# Altium project carte_action.PrjPcb
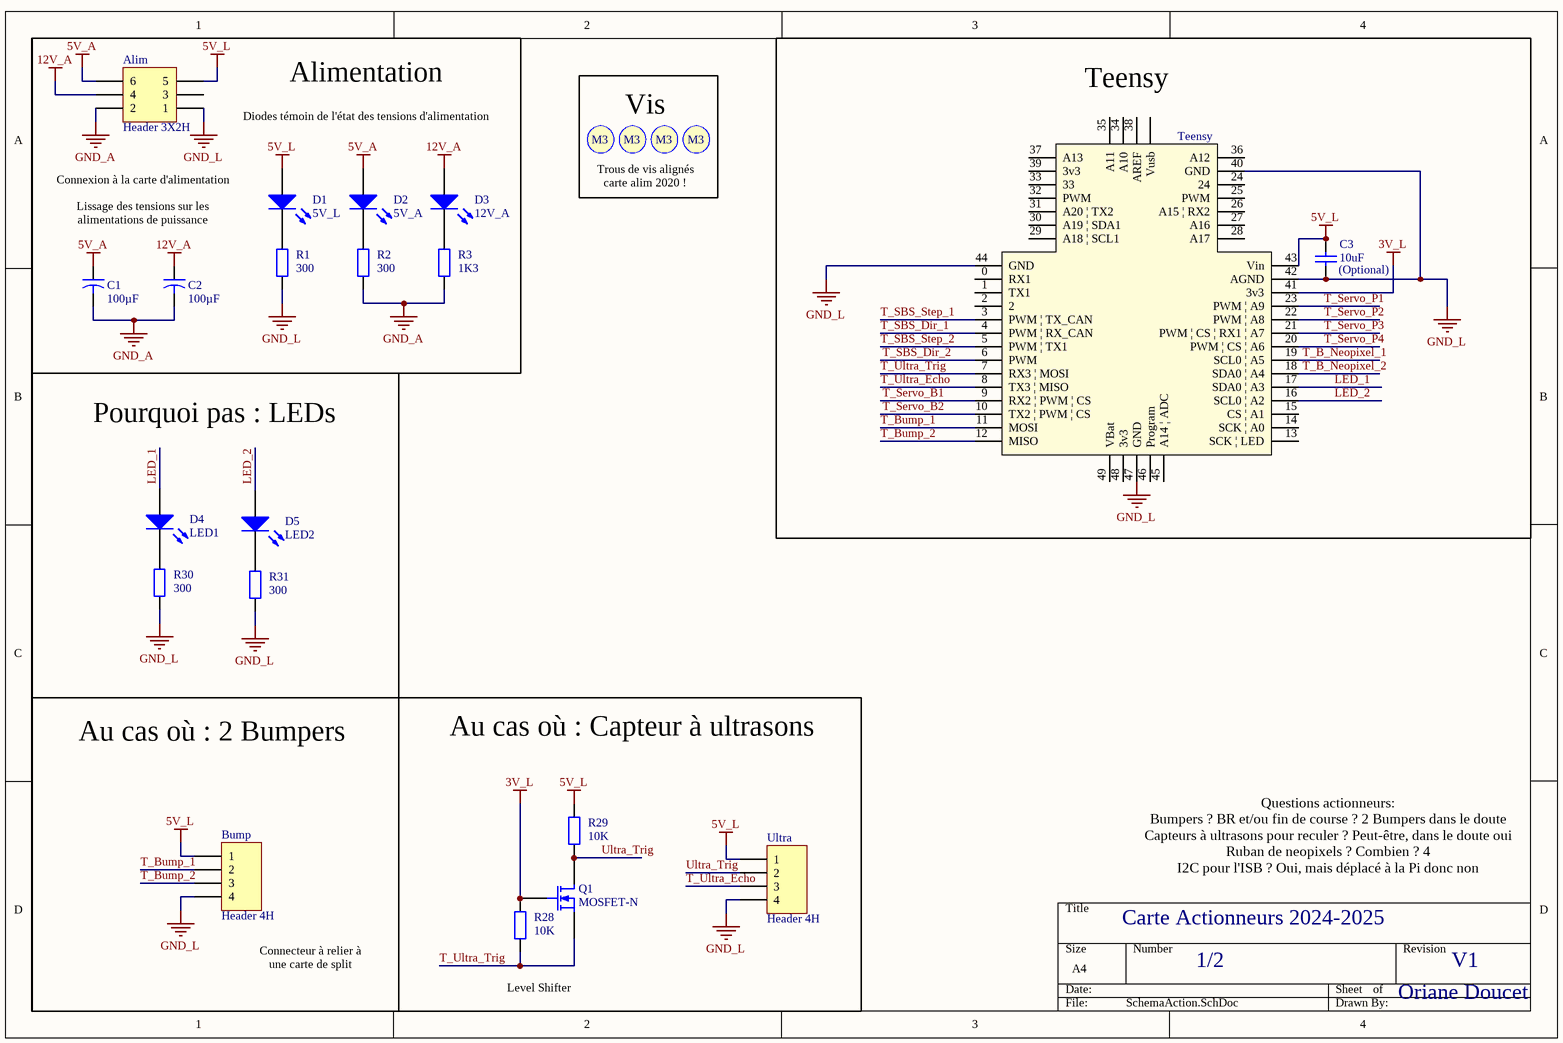
[diagram p0: SchemaAction.SchDoc]
2 sheets, 65 parts. Net scope: global (net labels, ports and power ports of the same name join across sheets).
Board file: PCBAction.PcbDoc
Sheets:
  SchemaAction.SchDoc
  SchemaAction_Actionneurs.SchDoc

## Sheet SchemaAction.SchDoc: Carte Actionneurs 2024-2025
size A4; DrawnBy: Oriane Doucet; DocumentNumber: 1/2; Revision: V1; SheetNumber: 1; SheetTotal: 2

### Parts
Alim  Header 3X2H  [MOLEX_MINIFITJR_3X2]
Bump  Header 4H  [S4B-XH-A]
C1  value 100µF  [Condensateur]  (hidden comment: Cap2)
C2  value 100µF  [Condensateur]  (hidden comment: Cap2)
C3  (Optional)  value 10uF  [Capacitor 1206]
D1  5V_L  [KP-3216SEC]
D2  5V_A  [KP-3216SEC]
D3  12V_A  [KP-3216SEC]
D4  LED1  [KP-3216SEC]
D5  LED2  [KP-3216SEC]
Q1  MOSFET-N  [SOT23_M]
R1  value 300  [Resistor 1206]  (hidden comment: Res2)
R2  value 300  [Resistor 1206]  (hidden comment: Res2)
R3  value 1K3  [Resistor 1206]  (hidden comment: Res2)
R28  value 10K  [Resistor 1206]  (hidden comment: Res2)
R29  value 10K  [Resistor 1206]  (hidden comment: Res2)
R30  value 300  [Resistor 1206]  (hidden comment: Res2)
R31  value 300  [Resistor 1206]  (hidden comment: Res2)
S1  Screw M3  [Screw M3]  (value not drawn)
S2  Screw M3  [Screw M3]  (value not drawn)
S3  Screw M3  [Screw M3]  (value not drawn)
S4  Screw M3  [Screw M3]  (value not drawn)
Teensy  Teensy 3.2  [teensy]  (value not drawn)
Ultra  Header 4H  [S4B-XH-A]

### Nets
3V_L: Q1.2(G) R28.1 Teensy.41(3v3)
5V_A: Alim.6 C1.1 D2.1(A)
5V_L: Alim.5 Bump.1 C3.2 D1.1(A) R29.1 Teensy.43(Vin) Ultra.1
12V_A: Alim.4 C2.1 D3.1(A)
GND_A: Alim.2 C1.2 C2.2 R2.2 R3.2
GND_L: Alim.1 Bump.4 C3.1 R1.1 R30.1 R31.1 Teensy.40(GND) Teensy.42(AGND) Teensy.44(GND) Teensy.47(GND) Ultra.4
LED_1: D4.1(A) Teensy.17(SDA0_|_A3)
LED_2: D5.1(A) Teensy.16(SCL0_|_A2)
T_B_Neopixel_1: Teensy.19(SCL0_|_A5)
T_B_Neopixel_2: Teensy.18(SDA0_|_A4)
T_Bump_1: Bump.2 Teensy.11(MOSI)
T_Bump_2: Bump.3 Teensy.12(MISO)
T_SBS_Dir_1: Teensy.4(PWM_|_RX_CAN)
T_SBS_Dir_2: Teensy.6(PWM)
T_SBS_Step_1: Teensy.3(PWM_|_TX_CAN)
T_SBS_Step_2: Teensy.5(PWM_|_TX1)
T_Servo_B1: Teensy.9(RX2_|_PWM_|_CS)
T_Servo_B2: Teensy.10(TX2_|_PWM_|_CS)
T_Servo_P1: Teensy.23(PWM_|_A9)
T_Servo_P2: Teensy.22(PWM_|_A8)
T_Servo_P3: Teensy.21(PWM_|_CS_|_RX1_|_A7)
T_Servo_P4: Teensy.20(PWM_|_CS_|_A6)
T_Ultra_Echo: Teensy.8(TX3_|_MISO) Ultra.3
T_Ultra_Trig: Q1.3(S) R28.2 Teensy.7(RX3_|_MOSI)
Ultra_Trig: Q1.1(D) R29.2 Ultra.2
NetD1_2: D1.2(K) R1.2
NetD2_2: D2.2(K) R2.1
NetD3_2: D3.2(K) R3.1
NetD4_2: D4.2(K) R30.2
NetD5_2: D5.2(K) R31.2

Not connected (* = marked no-connect by the designer): Alim 3; Teensy 0(RX1) 1(TX1) 2 13(SCK_|_LED) 14(SCK_|_A0) 15(CS_|_A1) 24 25(PWM) 26(A15_|_RX2) 27(A16) 28(A17) 29(A18_|_SCL1) 30(A19_|_SDA1) 31(A20_|_TX2) 32(PWM) 33 34(A10) 35(A11) 36(A12) 37(A13) 38(AREF) 39(3v3) 45(A14_|_ADC) 46(Program) 48(3v3) 49(VBat) 50(Vusb)

### Notes on the sheet
- Alimentation
- Vis
- (near Teensy) Teensy
- Connexion à la carte d'alimentation
- Diodes témoin de l'état des tensions d'alimentation
- Trous de vis alignés carte alim 2020 !
- Lissage des tensions sur les alimentations de puissance
- Pourquoi pas : LEDs
- Au cas où : 2 Bumpers
- Au cas où : Capteur à ultrasons
- Questions actionneurs:
  Bumpers ? BR et/ou fin de course ? 2 Bumpers dans le doute
  Capteurs à ultrasons pour reculer ? Peut-être, dans le doute oui
  Ruban de neopixels ? Combien ? 4
  I2C pour l'ISB ? Oui, mais déplacé à la Pi donc non
- Connecteur à relier à une carte de split
- (near R28) Level Shifter
- (in symbol Screw M3) M3

### Library data of the parts
Alim = Header 3X2H: Header, 3-Pin, Dual row, Right Angle; LatestRevisionDate: 17-Jul-2002; LatestRevisionNote: Re-released for DXP Platform.; Publisher: Altium Limited
Bump Ultra = Header 4H: Header, 4-Pin, Right Angle; LatestRevisionDate: 17-Jul-2002; LatestRevisionNote: Re-released for DXP Platform.; Publisher: Altium Limited
C1 C2 = Cap2: Capacitor; Published: 23-Sep-2002; PackageReference: CAPR5-4X5; Publisher: Altium Limited; PackageDescription: Capacitor; 2 Leads
C3 = Cap: Capacitor; Published: 8-Jun-2000; LatestRevisionDate: 17-Jul-2002; LatestRevisionNote: Re-released for DXP Platform.; PackageReference: RAD-0.3; Publisher: Altium Limited; PackageDescription: Radial Cap, Thru-Hole; 2 Leads; 0.3 in Pin Spacing
D1-D5 = LED2: Typical RED, GREEN, YELLOW, AMBER GaAs LED; Published: 8-Jun-2000; LatestRevisionDate: 17-Jul-2002; LatestRevisionNote: Re-released for DXP Platform.; PackageVersion: Feb-2002; PackageReference: 3.2X1.6X1.1; Publisher: Altium Limited; PackageDescription: SM LED; 2 Flat Leads
Q1 = MOSFET-N: N-Channel MOSFET; pin to pad: 2>3 3>2; Published: 8-Jun-2000; LatestRevisionDate: 17-Jul-2002; LatestRevisionNote: Re-released for DXP Platform.; PackageVersion: 1995/1996; PackageReference: E3; Publisher: Altium Limited; PackageDescription: TO, Flat Index; 3 In-Line, Axial Leads; Body Dia. 4.6mm; Lead Dia. 0.5 mm (max)
R1-R3 R28-R31 = Res2: Resistor; Published: 8-Jun-2000; LatestRevisionDate: 17-Jul-2002; LatestRevisionNote: Re-released for DXP Platform.; PackageReference: AXIAL-0.4; Publisher: Altium Limited; PackageDescription: Axial Device, Thru-Hole; 2 Leads; 0.4 in Pin Spacing
Teensy = teensy3.2

## Sheet SchemaAction_Actionneurs.SchDoc: Carte Actionneurs 2024-2025
size A4; DrawnBy: Oriane Doucet; DocumentNumber: 2/2; Revision: V1; SheetNumber: 2; SheetTotal: 2
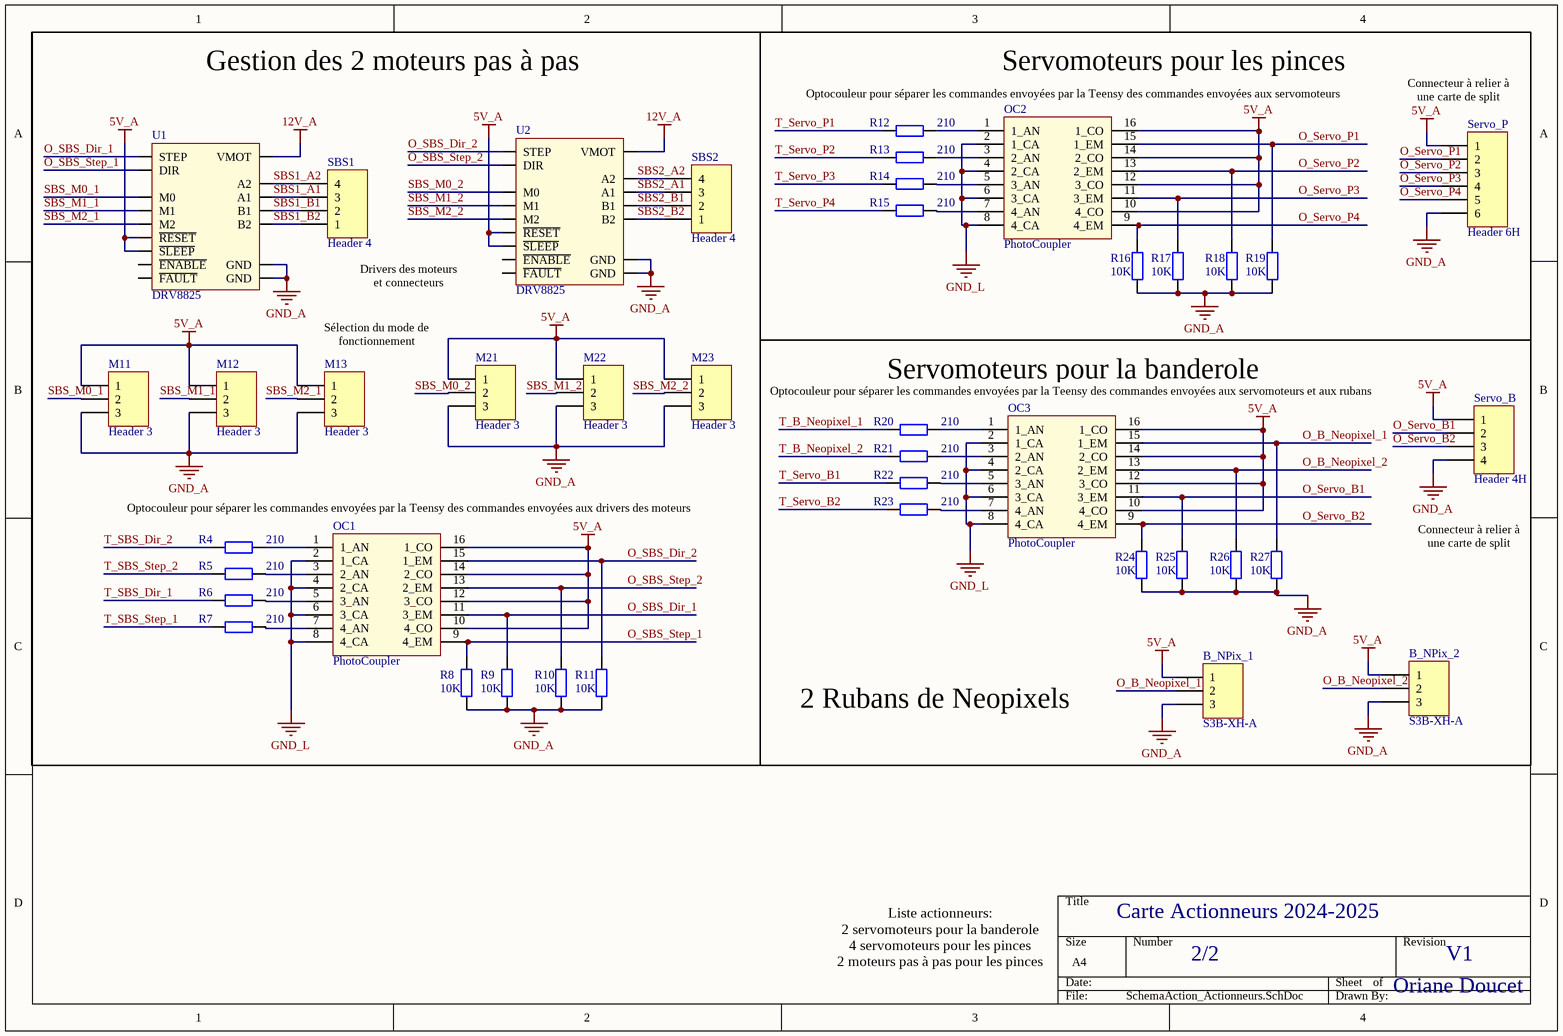
[diagram p1: SchemaAction_Actionneurs.SchDoc]

### Parts
B_NPix_1  S3B-XH-A  [S3B-XH-A]
B_NPix_2  S3B-XH-A  [S3B-XH-A]
M11  Header 3  [HDR1X3]
M12  Header 3  [HDR1X3]
M13  Header 3  [HDR1X3]
M21  Header 3  [HDR1X3]
M22  Header 3  [HDR1X3]
M23  Header 3  [HDR1X3]
OC1  PhotoCoupler  [16 pins SOIC, TI]
OC2  PhotoCoupler  [16 pins SOIC, TI]
OC3  PhotoCoupler  [16 pins SOIC, TI]
R4  value 210  [Resistor 1206]  (hidden comment: Res2)
R5  value 210  [Resistor 1206]  (hidden comment: Res2)
R6  value 210  [Resistor 1206]  (hidden comment: Res2)
R7  value 210  [Resistor 1206]  (hidden comment: Res2)
R8  value 10K  [Resistor 1206]  (hidden comment: Res2)
R9  value 10K  [Resistor 1206]  (hidden comment: Res2)
R10  value 10K  [Resistor 1206]  (hidden comment: Res2)
R11  value 10K  [Resistor 1206]  (hidden comment: Res2)
R12  value 210  [Resistor 1206]  (hidden comment: Res2)
R13  value 210  [Resistor 1206]  (hidden comment: Res2)
R14  value 210  [Resistor 1206]  (hidden comment: Res2)
R15  value 210  [Resistor 1206]  (hidden comment: Res2)
R16  value 10K  [Resistor 1206]  (hidden comment: Res2)
R17  value 10K  [Resistor 1206]  (hidden comment: Res2)
R18  value 10K  [Resistor 1206]  (hidden comment: Res2)
R19  value 10K  [Resistor 1206]  (hidden comment: Res2)
R20  value 210  [Resistor 1206]  (hidden comment: Res2)
R21  value 210  [Resistor 1206]  (hidden comment: Res2)
R22  value 210  [Resistor 1206]  (hidden comment: Res2)
R23  value 210  [Resistor 1206]  (hidden comment: Res2)
R24  value 10K  [Resistor 1206]  (hidden comment: Res2)
R25  value 10K  [Resistor 1206]  (hidden comment: Res2)
R26  value 10K  [Resistor 1206]  (hidden comment: Res2)
R27  value 10K  [Resistor 1206]  (hidden comment: Res2)
SBS1  Header 4  [S4B-XH-A]
SBS2  Header 4  [S4B-XH-A]
Servo_B  Header 4H  [S4B-XH-A]
Servo_P  Header 6H  [S6B-XH-A]
U1  DRV8825  [DRV8825]
U2  DRV8825  [DRV8825]

### Nets
5V_A: B_NPix_1.1 B_NPix_2.1 M11.1 M12.1 M13.1 M21.1 M22.1 M23.1 OC1.10(4_CO) OC1.12(3_CO) OC1.14(2_CO) OC1.16(1_CO) OC2.10(4_CO) OC2.12(3_CO) OC2.14(2_CO) OC2.16(1_CO) OC3.10(4_CO) OC3.12(3_CO) OC3.14(2_CO) OC3.16(1_CO) Servo_B.1 Servo_P.1 U1.5(~{RESET}) U1.6(~{SLEEP}) U2.5(~{RESET}) U2.6(~{SLEEP})
12V_A: U1.16(VMOT) U2.16(VMOT)
GND_A: B_NPix_1.3 B_NPix_2.3 M11.3 M12.3 M13.3 M21.3 M22.3 M23.3 R8.1 R9.1 R10.1 R11.1 R16.1 R17.1 R18.1 R19.1 R24.1 R25.1 R26.1 R27.1 Servo_B.4 Servo_P.6 U1.9(GND) U1.15(GND) U2.9(GND) U2.15(GND)
GND_L: OC1.2(1_CA) OC1.4(2_CA) OC1.6(3_CA) OC1.8(4_CA) OC2.2(1_CA) OC2.4(2_CA) OC2.6(3_CA) OC2.8(4_CA) OC3.2(1_CA) OC3.4(2_CA) OC3.6(3_CA) OC3.8(4_CA)
O_B_Neopixel_1: B_NPix_1.2 OC3.15(1_EM) R27.2
O_B_Neopixel_2: B_NPix_2.2 OC3.13(2_EM) R26.2
O_SBS_Dir_1: OC1.11(3_EM) R9.2 U1.7(STEP)
O_SBS_Dir_2: OC1.15(1_EM) R11.2 U2.7(STEP)
O_SBS_Step_1: OC1.9(4_EM) R8.2 U1.8(DIR)
O_SBS_Step_2: OC1.13(2_EM) R10.2 U2.8(DIR)
O_Servo_B1: OC3.11(3_EM) R25.2 Servo_B.2
O_Servo_B2: OC3.9(4_EM) R24.2 Servo_B.3
O_Servo_P1: OC2.15(1_EM) R19.2 Servo_P.2
O_Servo_P2: OC2.13(2_EM) R18.2 Servo_P.3
O_Servo_P3: OC2.11(3_EM) R17.2 Servo_P.4
O_Servo_P4: OC2.9(4_EM) R16.2 Servo_P.5
SBS1_A1: SBS1.3 U1.12(A1)
SBS1_A2: SBS1.4 U1.11(A2)
SBS1_B1: SBS1.2 U1.13(B1)
SBS1_B2: SBS1.1 U1.14(B2)
SBS2_A1: SBS2.3 U2.12(A1)
SBS2_A2: SBS2.4 U2.11(A2)
SBS2_B1: SBS2.2 U2.13(B1)
SBS2_B2: SBS2.1 U2.14(B2)
SBS_M0_1: M11.2 U1.2(M0)
SBS_M0_2: M21.2 U2.2(M0)
SBS_M1_1: M12.2 U1.3(M1)
SBS_M1_2: M22.2 U2.3(M1)
SBS_M2_1: M13.2 U1.4(M2)
SBS_M2_2: M23.2 U2.4(M2)
T_B_Neopixel_1: R20.2
T_B_Neopixel_2: R21.2
T_SBS_Dir_1: R6.2
T_SBS_Dir_2: R4.2
T_SBS_Step_1: R7.2
T_SBS_Step_2: R5.2
T_Servo_B1: R22.2
T_Servo_B2: R23.2
T_Servo_P1: R12.2
T_Servo_P2: R13.2
T_Servo_P3: R14.2
T_Servo_P4: R15.2
NetOC1_1: OC1.1(1_AN) R4.1
NetOC1_3: OC1.3(2_AN) R5.1
NetOC1_5: OC1.5(3_AN) R6.1
NetOC1_7: OC1.7(4_AN) R7.1
NetOC2_1: OC2.1(1_AN) R12.1
NetOC2_3: OC2.3(2_AN) R13.1
NetOC2_5: OC2.5(3_AN) R14.1
NetOC2_7: OC2.7(4_AN) R15.1
NetOC3_1: OC3.1(1_AN) R20.1
NetOC3_3: OC3.3(2_AN) R21.1
NetOC3_5: OC3.5(3_AN) R22.1
NetOC3_7: OC3.7(4_AN) R23.1

Not connected (* = marked no-connect by the designer): U1 1(~{ENABLE}) 10(~{FAULT}); U2 1(~{ENABLE}) 10(~{FAULT})

### Notes on the sheet
- Gestion des 2 moteurs pas à pas
- Optocouleur pour séparer les commandes envoyées par la Teensy des commandes envoyées aux servomoteurs
- Servomoteurs pour les pinces
- (near Servo_P) Connecteur à relier à une carte de split
- Drivers des moteurs et connecteurs
- Sélection du mode de fonctionnement
- Servomoteurs pour la banderole
- Optocouleur pour séparer les commandes envoyées par la Teensy des commandes envoyées aux servomoteurs et aux rubans
- Optocouleur pour séparer les commandes envoyées par la Teensy des commandes envoyées aux drivers des moteurs
- Connecteur à relier à une carte de split
- 2 Rubans de Neopixels
- Liste actionneurs:
  2 servomoteurs pour la banderole
  4 servomoteurs pour les pinces
  2 moteurs pas à pas pour les pinces

### Library data of the parts
B_NPix_1 B_NPix_2 = Header 3H: Header, 3-Pin, Right Angle; LatestRevisionDate: 17-Jul-2002; LatestRevisionNote: Re-released for DXP Platform.; Publisher: Altium Limited
M11-M13 M21-M23 = Header 3: Header, 3-Pin; LatestRevisionDate: 17-Jul-2002; LatestRevisionNote: Re-released for DXP Platform.; Publisher: Altium Limited
OC1-OC3 = LTV-247: Integrated Circuit; Manufacturer_Name: Lite-On; Datasheet Link: http://optoelectronics.liteon.com/upload/download/DS70-2009-0014/LTV-2X7%20sereis%20Mar17.PDF; Manufacturer_Part_Number: LTV-247; Mouser Part Number: 859-LTV-247; Mouser Price/Stock: https://www.mouser.co.uk/ProductDetail/Lite-On/LTV-247/?qs=9ayhpukWNmvWpoxQBzWkFA%3D%3D; Arrow Part Number: LTV-247; Arrow Price/Stock: https://www.arrow.com/en/products/ltv-247/lite-on-technology
R4-R27 = Res2: Resistor; Published: 8-Jun-2000; LatestRevisionDate: 17-Jul-2002; LatestRevisionNote: Re-released for DXP Platform.; PackageReference: AXIAL-0.4; Publisher: Altium Limited; PackageDescription: Axial Device, Thru-Hole; 2 Leads; 0.4 in Pin Spacing
SBS1 SBS2 = Header 4: Header, 4-Pin; LatestRevisionDate: 17-Jul-2002; LatestRevisionNote: Re-released for DXP Platform.; Publisher: Altium Limited
Servo_B = Header 4H: Header, 4-Pin, Right Angle; LatestRevisionDate: 17-Jul-2002; LatestRevisionNote: Re-released for DXP Platform.; Publisher: Altium Limited
Servo_P = Header 6H: Header, 6-Pin, Right Angle; LatestRevisionDate: 17-Jul-2002; LatestRevisionNote: Re-released for DXP Platform.; Publisher: Altium Limited
U1 U2 = DRV8825: Stepper Driver Module

## Nets that join several sheets
5V_A: SchemaAction (Alim.6 C1.1 D2.1), SchemaAction_Actionneurs (26 pins)
12V_A: SchemaAction (Alim.4 C2.1 D3.1), SchemaAction_Actionneurs (U1.16 U2.16)
GND_A: SchemaAction (5 pins), SchemaAction_Actionneurs (26 pins)
GND_L: SchemaAction (11 pins), SchemaAction_Actionneurs (12 pins)
T_B_Neopixel_1: SchemaAction (Teensy.19), SchemaAction_Actionneurs (R20.2)
T_B_Neopixel_2: SchemaAction (Teensy.18), SchemaAction_Actionneurs (R21.2)
T_SBS_Dir_1: SchemaAction (Teensy.4), SchemaAction_Actionneurs (R6.2)
T_SBS_Dir_2: SchemaAction (Teensy.6), SchemaAction_Actionneurs (R4.2)
T_SBS_Step_1: SchemaAction (Teensy.3), SchemaAction_Actionneurs (R7.2)
T_SBS_Step_2: SchemaAction (Teensy.5), SchemaAction_Actionneurs (R5.2)
T_Servo_B1: SchemaAction (Teensy.9), SchemaAction_Actionneurs (R22.2)
T_Servo_B2: SchemaAction (Teensy.10), SchemaAction_Actionneurs (R23.2)
T_Servo_P1: SchemaAction (Teensy.23), SchemaAction_Actionneurs (R12.2)
T_Servo_P2: SchemaAction (Teensy.22), SchemaAction_Actionneurs (R13.2)
T_Servo_P3: SchemaAction (Teensy.21), SchemaAction_Actionneurs (R14.2)
T_Servo_P4: SchemaAction (Teensy.20), SchemaAction_Actionneurs (R15.2)